# Altium schematic sheet RGMII_SDIO_I2S.SchDoc
size 420 x 297 mm; SheetNumber: 5; SheetTotal: 26
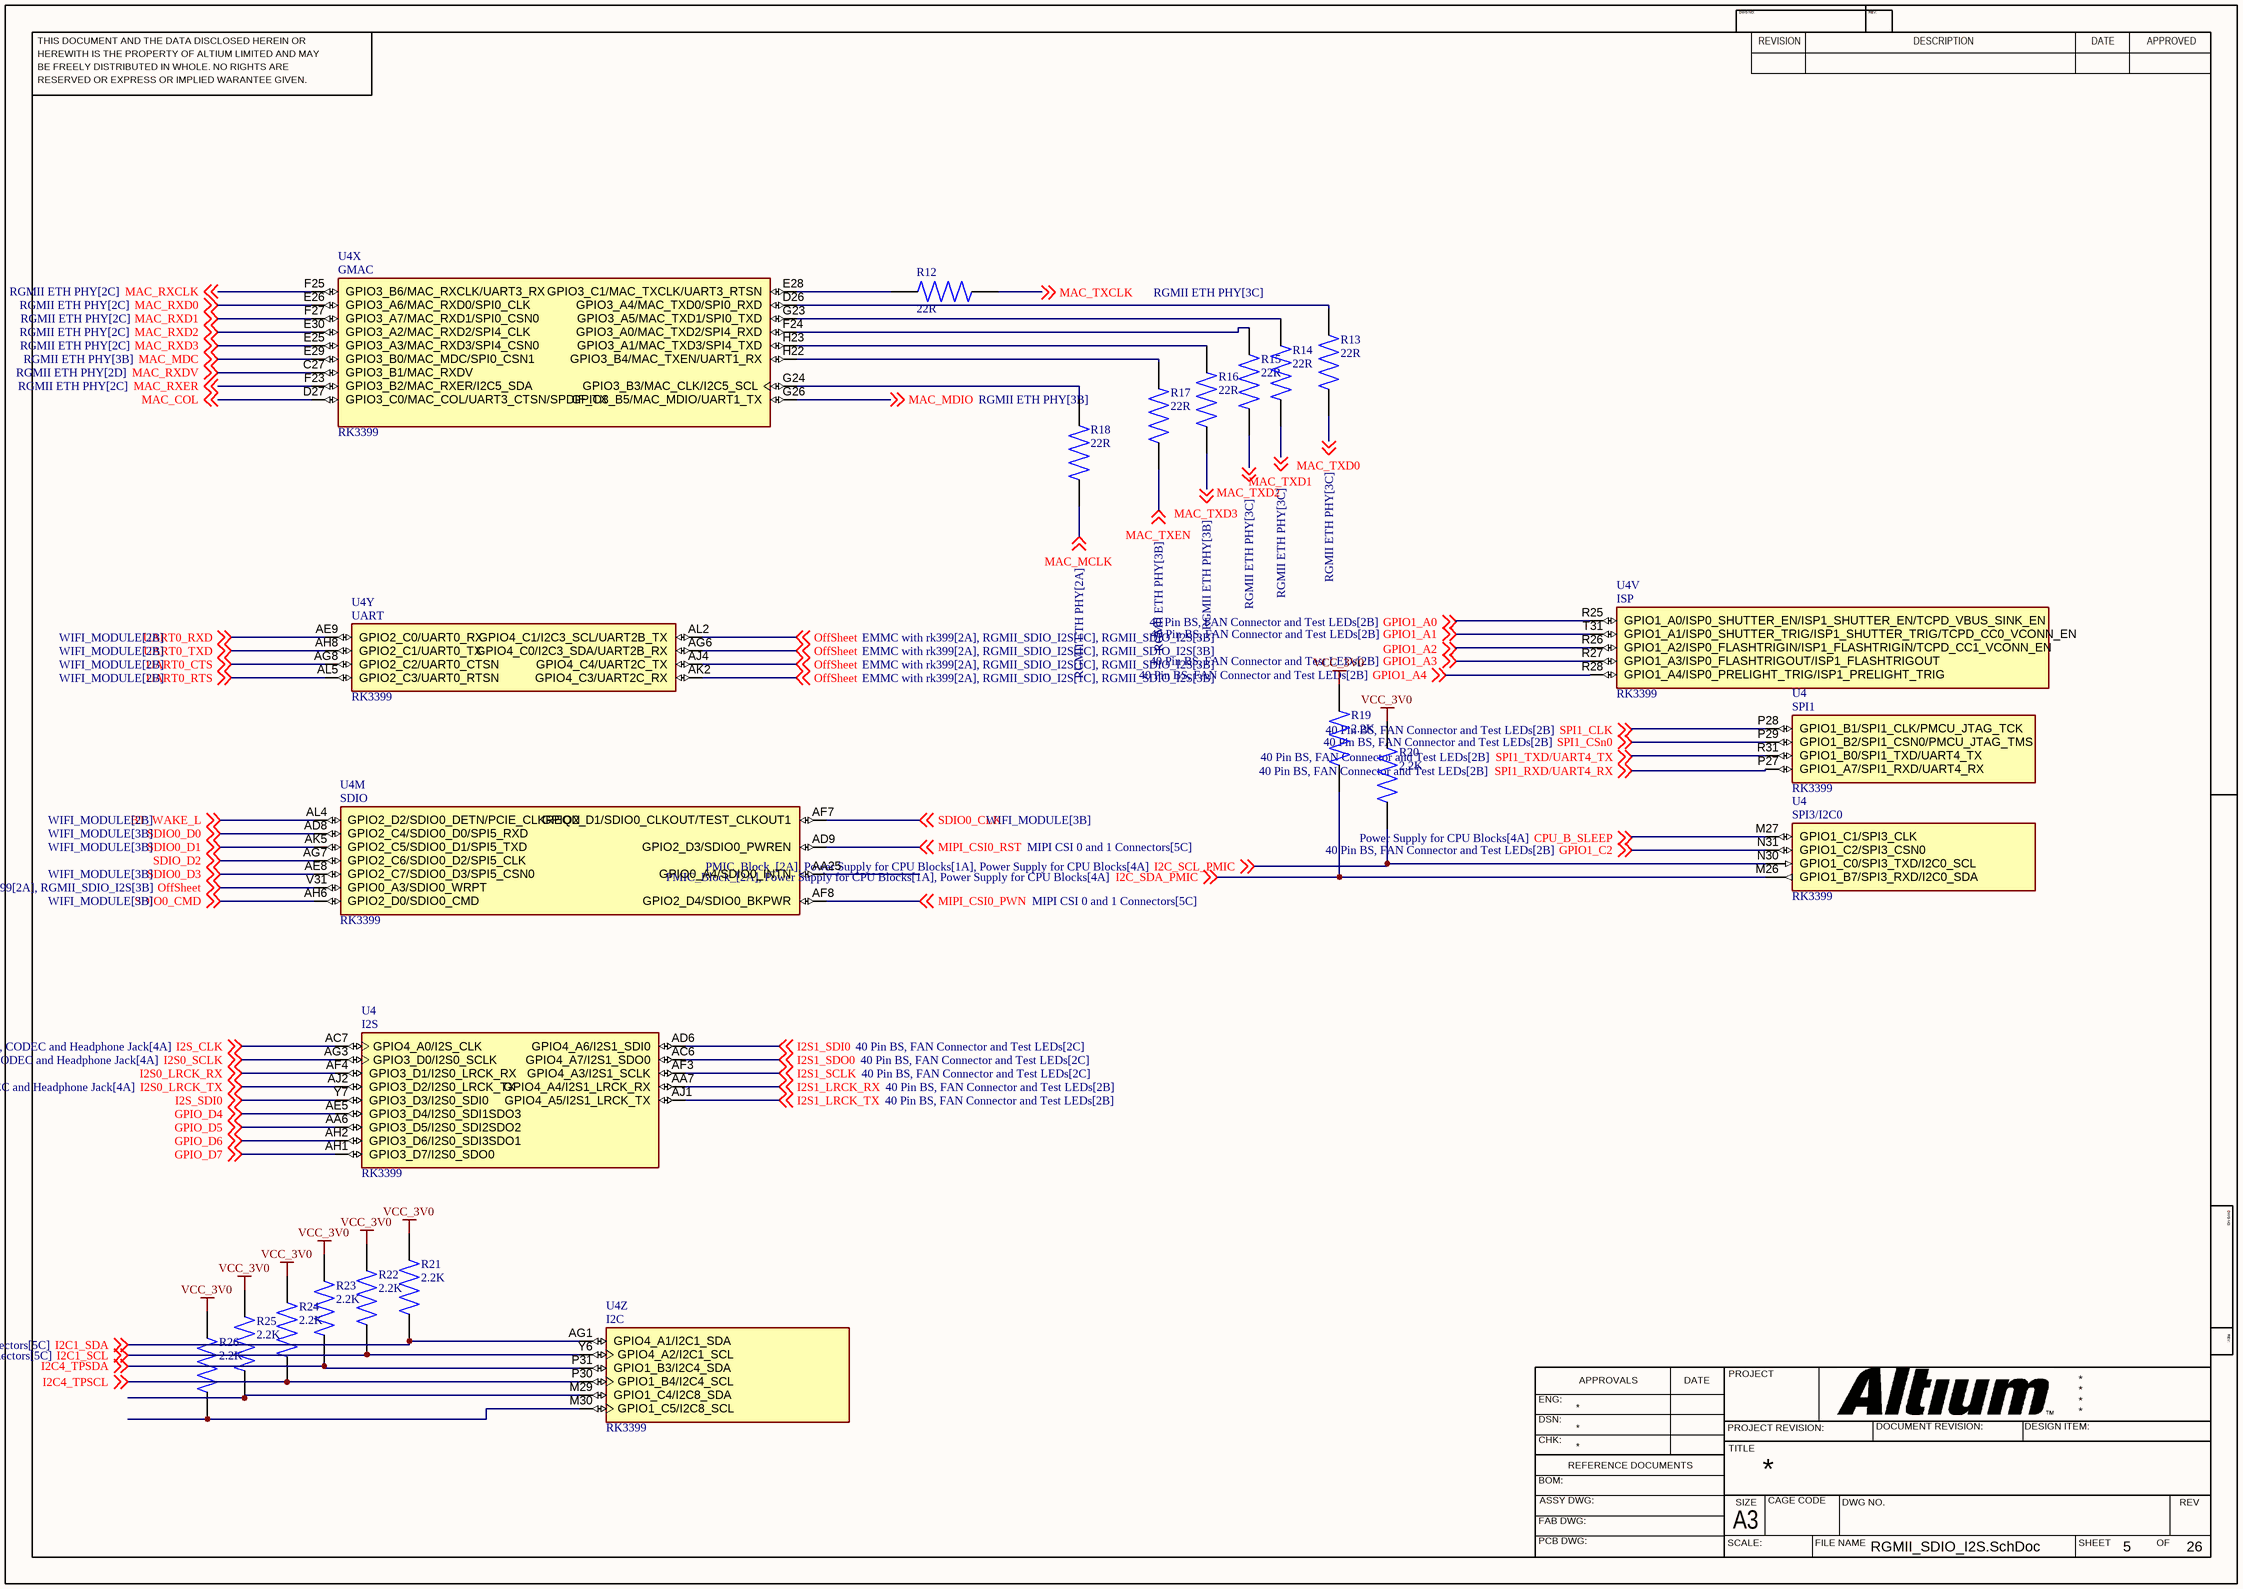
[diagram p0: RGMII_SDIO_I2S.SchDoc]

## Parts
R12  22R  [RES_ERA6AHD330V]
R13  22R  [RES_ERA6AHD330V]
R14  22R  [RES_ERA6AHD330V]
R15  22R  [RES_ERA6AHD330V]
R16  22R  [RES_ERA6AHD330V]
R17  22R  [RES_ERA6AHD330V]
R18  22R  [RES_ERA6AHD330V]
R19  2.2K  [RES_ERA8APB222V]
R20  2.2K  [RES_ERA8APB222V]
R21  2.2K  [RES_ERA8APB222V]
R22  2.2K  [RES_ERA8APB222V]
R23  2.2K  [RES_ERA8APB222V]
R24  2.2K  [RES_ERA8APB222V]
R25  2.2K  [RES_ERA8APB222V]
R26  2.2K  [RES_ERA8APB222V]
U4  RK3399  [BGA828C65P31X31_2100X2100X161N]  (parts M,V,X,Y,Z,30,31,32 of 32)

## Nets
VCC_3V0: R19.2 R20.2 R21.2 R22.2 R23.2 R24.2 R25.2 R26.2
BT_WAKE_L: U4.AL4(GPIO2_D2/SDIO0_DETN/PCIE_CLKREQN) ; off-sheet BT_WAKE_L
CPU_B_SLEEP: U4.M27(GPIO1_C1/SPI3_CLK) ; off-sheet CPU_B_SLEEP
GPIO1_A0: U4.R25(GPIO1_A0/ISP0_SHUTTER_EN/ISP1_SHUTTER_EN/TCPD_VBUS_SINK_EN) ; off-sheet GPIO1_A0
GPIO1_A1: U4.T31(GPIO1_A1/ISP0_SHUTTER_TRIG/ISP1_SHUTTER_TRIG/TCPD_CC0_VCONN_EN) ; off-sheet GPIO1_A1
GPIO1_A2: U4.R26(GPIO1_A2/ISP0_FLASHTRIGIN/ISP1_FLASHTRIGIN/TCPD_CC1_VCONN_EN) ; off-sheet GPIO1_A2
GPIO1_A3: U4.R27(GPIO1_A3/ISP0_FLASHTRIGOUT/ISP1_FLASHTRIGOUT) ; off-sheet GPIO1_A3
GPIO1_A4: U4.R28(GPIO1_A4/ISP0_PRELIGHT_TRIG/ISP1_PRELIGHT_TRIG) ; off-sheet GPIO1_A4
GPIO1_C2: U4.N31(GPIO1_C2/SPI3_CSN0) ; off-sheet GPIO1_C2
GPIO_D4: U4.AE5(GPIO3_D4/I2S0_SDI1SDO3) ; off-sheet GPIO_D4
GPIO_D5: U4.AA6(GPIO3_D5/I2S0_SDI2SDO2) ; off-sheet GPIO_D5
GPIO_D6: U4.AH2(GPIO3_D6/I2S0_SDI3SDO1) ; off-sheet GPIO_D6
GPIO_D7: U4.AH1(GPIO3_D7/I2S0_SDO0) ; off-sheet GPIO_D7
I2C1_SCL: R22.1 U4.Y6(GPIO4_A2/I2C1_SCL) ; off-sheet I2C1_SCL
I2C1_SDA: R21.1 U4.AG1(GPIO4_A1/I2C1_SDA) ; off-sheet I2C1_SDA
I2C4_TPSCL: R24.1 U4.P30(GPIO1_B4/I2C4_SCL) ; off-sheet I2C4_TPSCL
I2C4_TPSDA: R23.1 U4.P31(GPIO1_B3/I2C4_SDA) ; off-sheet I2C4_TPSDA
I2C_SCL_PMIC: R20.1 U4.N30(GPIO1_C0/SPI3_TXD/I2C0_SCL) ; off-sheet I2C_SCL_PMIC
I2C_SDA_PMIC: R19.1 U4.M26(GPIO1_B7/SPI3_RXD/I2C0_SDA) ; off-sheet I2C_SDA_PMIC
I2S0_LRCK_RX: U4.AF4(GPIO3_D1/I2S0_LRCK_RX) ; off-sheet I2S0_LRCK_RX
I2S0_LRCK_TX: U4.AJ2(GPIO3_D2/I2S0_LRCK_TX) ; off-sheet I2S0_LRCK_TX
I2S0_SCLK: U4.AG3(GPIO3_D0/I2S0_SCLK) ; off-sheet I2S0_SCLK
I2S1_LRCK_RX: U4.AA7(GPIO4_A4/I2S1_LRCK_RX) ; off-sheet I2S1_LRCK_RX
I2S1_LRCK_TX: U4.AJ1(GPIO4_A5/I2S1_LRCK_TX) ; off-sheet I2S1_LRCK_TX
I2S1_SCLK: U4.AF3(GPIO4_A3/I2S1_SCLK) ; off-sheet I2S1_SCLK
I2S1_SDI0: U4.AD6(GPIO4_A6/I2S1_SDI0) ; off-sheet I2S1_SDI0
I2S1_SDO0: U4.AC6(GPIO4_A7/I2S1_SDO0) ; off-sheet I2S1_SDO0
I2S_CLK: U4.AC7(GPIO4_A0/I2S_CLK) ; off-sheet I2S_CLK
I2S_SDI0: U4.Y7(GPIO3_D3/I2S0_SDI0) ; off-sheet I2S_SDI0
MAC_COL: U4.D27(GPIO3_C0/MAC_COL/UART3_CTSN/SPDIF_TX) ; off-sheet MAC_COL
MAC_MCLK: R18.1 ; off-sheet MAC_MCLK
MAC_MDC: U4.E29(GPIO3_B0/MAC_MDC/SPI0_CSN1) ; off-sheet MAC_MDC
MAC_MDIO: U4.G26(GPIO3_B5/MAC_MDIO/UART1_TX) ; off-sheet MAC_MDIO
MAC_RXCLK: U4.F25(GPIO3_B6/MAC_RXCLK/UART3_RX) ; off-sheet MAC_RXCLK
MAC_RXD0: U4.E26(GPIO3_A6/MAC_RXD0/SPI0_CLK) ; off-sheet MAC_RXD0
MAC_RXD1: U4.F27(GPIO3_A7/MAC_RXD1/SPI0_CSN0) ; off-sheet MAC_RXD1
MAC_RXD2: U4.E30(GPIO3_A2/MAC_RXD2/SPI4_CLK) ; off-sheet MAC_RXD2
MAC_RXD3: U4.E25(GPIO3_A3/MAC_RXD3/SPI4_CSN0) ; off-sheet MAC_RXD3
MAC_RXDV: U4.C27(GPIO3_B1/MAC_RXDV) ; off-sheet MAC_RXDV
MAC_RXER: U4.F23(GPIO3_B2/MAC_RXER/I2C5_SDA) ; off-sheet MAC_RXER
MAC_TXCLK: R12.1 ; off-sheet MAC_TXCLK
MAC_TXD0: R13.1 ; off-sheet MAC_TXD0
MAC_TXD1: R14.1 ; off-sheet MAC_TXD1
MAC_TXD2: R15.1 ; off-sheet MAC_TXD2
MAC_TXD3: R16.1 ; off-sheet MAC_TXD3
MAC_TXEN: R17.1 ; off-sheet MAC_TXEN
MIPI_CSI0_PWN: U4.AF8(GPIO2_D4/SDIO0_BKPWR) ; off-sheet MIPI_CSI0_PWN
MIPI_CSI0_RST: U4.AD9(GPIO2_D3/SDIO0_PWREN) ; off-sheet MIPI_CSI0_RST
OffSheet: U4.AG6(GPIO4_C0/I2C3_SDA/UART2B_RX) U4.AJ4(GPIO4_C4/UART2C_TX) U4.AK2(GPIO4_C3/UART2C_RX) U4.AL2(GPIO4_C1/I2C3_SCL/UART2B_TX) U4.V31(GPIO0_A3/SDIO0_WRPT) ; off-sheet OffSheet
SDIO0_CLK: U4.AF7(GPIO2_D1/SDIO0_CLKOUT/TEST_CLKOUT1) ; off-sheet SDIO0_CLK
SDIO0_CMD: U4.AH6(GPIO2_D0/SDIO0_CMD) ; off-sheet SDIO0_CMD
SDIO0_D0: U4.AD8(GPIO2_C4/SDIO0_D0/SPI5_RXD) ; off-sheet SDIO0_D0
SDIO0_D1: U4.AK5(GPIO2_C5/SDIO0_D1/SPI5_TXD) ; off-sheet SDIO0_D1
SDIO0_D3: U4.AE8(GPIO2_C7/SDIO0_D3/SPI5_CSN0) ; off-sheet SDIO0_D3
SDIO_D2: U4.AG7(GPIO2_C6/SDIO0_D2/SPI5_CLK) ; off-sheet SDIO_D2
SPI1_CLK: U4.P28(GPIO1_B1/SPI1_CLK/PMCU_JTAG_TCK) ; off-sheet SPI1_CLK
SPI1_CSn0: U4.P29(GPIO1_B2/SPI1_CSN0/PMCU_JTAG_TMS) ; off-sheet SPI1_CSn0
SPI1_RXD/UART4_RX: U4.P27(GPIO1_A7/SPI1_RXD/UART4_RX) ; off-sheet SPI1_RXD/UART4_RX
SPI1_TXD/UART4_TX: U4.R31(GPIO1_B0/SPI1_TXD/UART4_TX) ; off-sheet SPI1_TXD/UART4_TX
UART0_CTS: U4.AG8(GPIO2_C2/UART0_CTSN) ; off-sheet UART0_CTS
UART0_RTS: U4.AL5(GPIO2_C3/UART0_RTSN) ; off-sheet UART0_RTS
UART0_RXD: U4.AE9(GPIO2_C0/UART0_RX) ; off-sheet UART0_RXD
UART0_TXD: U4.AH8(GPIO2_C1/UART0_TX) ; off-sheet UART0_TXD
NetR12_2: R12.2 U4.E28(GPIO3_C1/MAC_TXCLK/UART3_RTSN)
NetR13_2: R13.2 U4.D26(GPIO3_A4/MAC_TXD0/SPI0_RXD)
NetR14_2: R14.2 U4.G23(GPIO3_A5/MAC_TXD1/SPI0_TXD)
NetR15_2: R15.2 U4.F24(GPIO3_A0/MAC_TXD2/SPI4_RXD)
NetR16_2: R16.2 U4.H23(GPIO3_A1/MAC_TXD3/SPI4_TXD)
NetR17_2: R17.2 U4.H22(GPIO3_B4/MAC_TXEN/UART1_RX)
NetR18_2: R18.2 U4.G24(GPIO3_B3/MAC_CLK/I2C5_SCL)
NetR25_1: R25.1 U4.M29(GPIO1_C4/I2C8_SDA)
NetR26_1: R26.1 U4.M30(GPIO1_C5/I2C8_SCL)

Not connected (* = marked no-connect by the designer): U4 AA25(GPIO0_A4/SDIO0_INTN)

## Notes on the sheet
- THIS DOCUMENT AND THE DATA DISCLOSED HEREIN OR
- HEREWITH IS THE PROPERTY OF ALTIUM LIMITED AND MAY
- DWG NO:
- REVISION
- REV:
- DESCRIPTION
- DATE
- APPROVED
- BE FREELY DISTRIBUTED IN WHOLE. NO RIGHTS ARE
- RESERVED OR EXPRESS OR IMPLIED WARANTEE GIVEN.
- ENG:
- APPROVALS
- PROJECT
- DSN:
- CHK:
- REFERENCE DOCUMENTS
- PROJECT REVISION:
- TITLE
- DOCUMENT REVISION:
- DESIGN ITEM:
- BOM:
- FAB DWG:
- PCB DWG:
- ASSY DWG:
- SCALE:
- A3
- SIZE
- CAGE CODE
- FILE NAME
- DWG NO.
- SHEET
- OF
- REV
- (in symbol RK3399, part M) SDIO
- (in symbol RK3399, part V) ISP
- (in symbol RK3399, part X) GMAC
- (in symbol RK3399, part Y) UART
- (in symbol RK3399, part Z) I2C
- (in symbol RK3399, part 30) SPI1
- (in symbol RK3399, part 31) SPI3/I2C0
- (in symbol RK3399, part 32) I2S

## Library data of the parts
R12-R18 = ERA6AHD330V: Package: None; MP: ERA6AHD330V; Price: None; Value: *; Availability: Unavailable
R19-R26 = ERA8APB222V: Availability: Unavailable; Price: None; Package: None; MP: ERA8APB222V; Value: *
U4 = RK3399: RK3399 ROCK Pi 4 Model A 2GB - ARMÂ® CortexÂ®-A53, CortexÂ®-A72 MPU Embedded Evaluation Board; MF: Rockchip; SnapEDA_Link: https://www.snapeda.com/parts/RK3399/Fuzhou+Rockchip+Electronics+Co/view-part/?ref=snap; Package: Seeed Technology; MP: RK3399; Check_prices: https://www.snapeda.com/parts/RK3399/Fuzhou+Rockchip+Electronics+Co/view-part/?ref=eda; Price: None; Value: *; Availability: Not in stock